# Altium schematic sheet 8_LEDS.SchDoc: SmartHalo V1.0 Rev1 - Leds
size B; Author: Sébastien Gélinas; Organization: CycleLabs Solutions Inc.; Address1: 5445 de Gaspé; Address2: Montréal, QC; Address3: Canada; Address4: H2T 3B2; Revision: 1; SheetNumber: 8; SheetTotal: 8
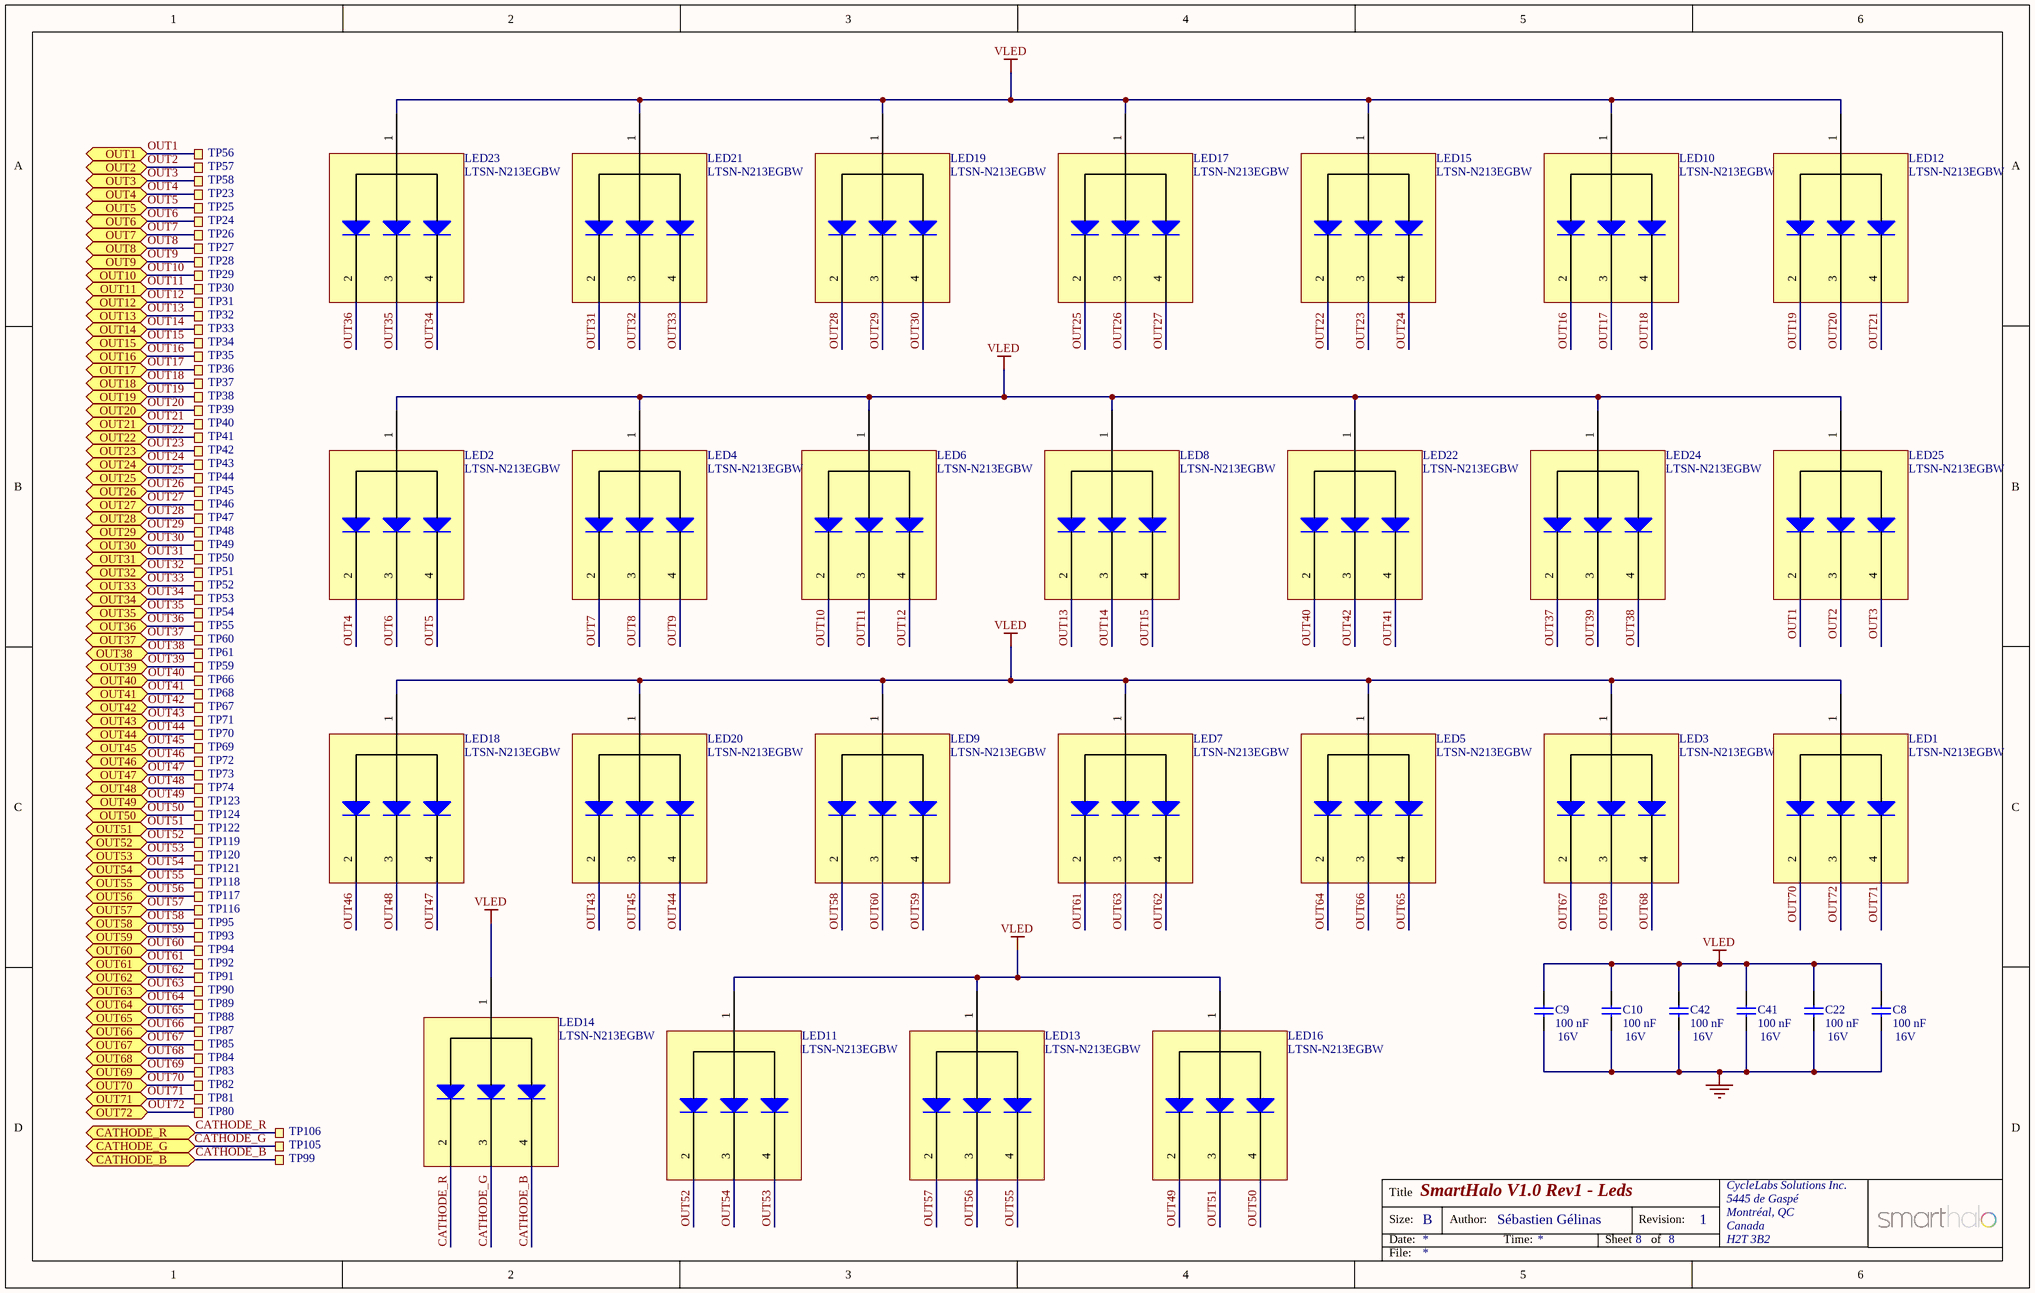
[diagram p0: 8_LEDS.SchDoc]

## Parts
C8  100 nF  Voltage Rating: 16V  [Varitron_CAP0402]
C9  100 nF  Voltage Rating: 16V  [Varitron_CAP0402]
C10  100 nF  Voltage Rating: 16V  [Varitron_CAP0402]
C22  100 nF  Voltage Rating: 16V  [Varitron_CAP0402]
C41  100 nF  Voltage Rating: 16V  [Varitron_CAP0402]
C42  100 nF  Voltage Rating: 16V  [Varitron_CAP0402]
LED1  LTSN-N213EGBW  [LTSN-N213EGBW]
LED2  LTSN-N213EGBW  [LTSN-N213EGBW]
LED3  LTSN-N213EGBW  [LTSN-N213EGBW]
LED4  LTSN-N213EGBW  [LTSN-N213EGBW]
LED5  LTSN-N213EGBW  [LTSN-N213EGBW]
LED6  LTSN-N213EGBW  [LTSN-N213EGBW]
LED7  LTSN-N213EGBW  [LTSN-N213EGBW]
LED8  LTSN-N213EGBW  [LTSN-N213EGBW]
LED9  LTSN-N213EGBW  [LTSN-N213EGBW]
LED10  LTSN-N213EGBW  [LTSN-N213EGBW]
LED11  LTSN-N213EGBW  [LTSN-N213EGBW]
LED12  LTSN-N213EGBW  [LTSN-N213EGBW]
LED13  LTSN-N213EGBW  [LTSN-N213EGBW]
LED14  LTSN-N213EGBW  [LTSN-N213EGBW]
LED15  LTSN-N213EGBW  [LTSN-N213EGBW]
LED16  LTSN-N213EGBW  [LTSN-N213EGBW]
LED17  LTSN-N213EGBW  [LTSN-N213EGBW]
LED18  LTSN-N213EGBW  [LTSN-N213EGBW]
LED19  LTSN-N213EGBW  [LTSN-N213EGBW]
LED20  LTSN-N213EGBW  [LTSN-N213EGBW]
LED21  LTSN-N213EGBW  [LTSN-N213EGBW]
LED22  LTSN-N213EGBW  [LTSN-N213EGBW]
LED23  LTSN-N213EGBW  [LTSN-N213EGBW]
LED24  LTSN-N213EGBW  [LTSN-N213EGBW]
LED25  LTSN-N213EGBW  [LTSN-N213EGBW]
TP23  TP23  [TESTPAD-TH-35mils]  (value not drawn)  (no BOM)
TP24  TP24  [TESTPAD-TH-35mils]  (value not drawn)  (no BOM)
TP25  TP25  [TESTPAD-TH-35mils]  (value not drawn)  (no BOM)
TP26  TP26  [TESTPAD-TH-35mils]  (value not drawn)  (no BOM)
TP27  TP27  [TESTPAD-TH-35mils]  (value not drawn)  (no BOM)
TP28  TP28  [TESTPAD-TH-35mils]  (value not drawn)  (no BOM)
TP29  TP29  [TESTPAD-TH-35mils]  (value not drawn)  (no BOM)
TP30  TP30  [TESTPAD-TH-35mils]  (value not drawn)  (no BOM)
TP31  TP31  [TESTPAD-TH-35mils]  (value not drawn)  (no BOM)
TP32  TP32  [TESTPAD-TH-35mils]  (value not drawn)  (no BOM)
TP33  TP33  [TESTPAD-TH-35mils]  (value not drawn)  (no BOM)
TP34  TP34  [TESTPAD-TH-35mils]  (value not drawn)  (no BOM)
TP35  TP35  [TESTPAD-TH-35mils]  (value not drawn)  (no BOM)
TP36  TP36  [TESTPAD-TH-35mils]  (value not drawn)  (no BOM)
TP37  TP37  [TESTPAD-TH-35mils]  (value not drawn)  (no BOM)
TP38  TP38  [TESTPAD-TH-35mils]  (value not drawn)  (no BOM)
TP39  TP39  [TESTPAD-TH-35mils]  (value not drawn)  (no BOM)
TP40  TP40  [TESTPAD-TH-35mils]  (value not drawn)  (no BOM)
TP41  TP41  [TESTPAD-TH-35mils]  (value not drawn)  (no BOM)
TP42  TP42  [TESTPAD-TH-35mils]  (value not drawn)  (no BOM)
TP43  TP43  [TESTPAD-TH-35mils]  (value not drawn)  (no BOM)
TP44  TP44  [TESTPAD-TH-35mils]  (value not drawn)  (no BOM)
TP45  TP45  [TESTPAD-TH-35mils]  (value not drawn)  (no BOM)
TP46  TP46  [TESTPAD-TH-35mils]  (value not drawn)  (no BOM)
TP47  TP47  [TESTPAD-TH-35mils]  (value not drawn)  (no BOM)
TP48  TP48  [TESTPAD-TH-35mils]  (value not drawn)  (no BOM)
TP49  TP49  [TESTPAD-TH-35mils]  (value not drawn)  (no BOM)
TP50  TP50  [TESTPAD-TH-35mils]  (value not drawn)  (no BOM)
TP51  TP51  [TESTPAD-TH-35mils]  (value not drawn)  (no BOM)
TP52  TP52  [TESTPAD-TH-35mils]  (value not drawn)  (no BOM)
TP53  TP53  [TESTPAD-TH-35mils]  (value not drawn)  (no BOM)
TP54  TP54  [TESTPAD-TH-35mils]  (value not drawn)  (no BOM)
TP55  TP55  [TESTPAD-TH-35mils]  (value not drawn)  (no BOM)
TP56  TP56  [TESTPAD-TH-35mils]  (value not drawn)  (no BOM)
TP57  TP57  [TESTPAD-TH-35mils]  (value not drawn)  (no BOM)
TP58  TP58  [TESTPAD-TH-35mils]  (value not drawn)  (no BOM)
TP59  TP59  [TESTPAD-TH-35mils]  (value not drawn)  (no BOM)
TP60  TP60  [TESTPAD-TH-35mils]  (value not drawn)  (no BOM)
TP61  TP61  [TESTPAD-TH-35mils]  (value not drawn)  (no BOM)
TP66  TP66  [TESTPAD-TH-35mils]  (value not drawn)  (no BOM)
TP67  TP67  [TESTPAD-TH-35mils]  (value not drawn)  (no BOM)
TP68  TP68  [TESTPAD-TH-35mils]  (value not drawn)  (no BOM)
TP69  TP69  [TESTPAD-TH-35mils]  (value not drawn)  (no BOM)
TP70  TP70  [TESTPAD-TH-35mils]  (value not drawn)  (no BOM)
TP71  TP71  [TESTPAD-TH-35mils]  (value not drawn)  (no BOM)
TP72  TP72  [TESTPAD-TH-35mils]  (value not drawn)  (no BOM)
TP73  TP73  [TESTPAD-TH-35mils]  (value not drawn)  (no BOM)
TP74  TP74  [TESTPAD-TH-35mils]  (value not drawn)  (no BOM)
TP80  TP80  [TESTPAD-TH-35mils]  (value not drawn)  (no BOM)
TP81  TP81  [TESTPAD-TH-35mils]  (value not drawn)  (no BOM)
TP82  TP82  [TESTPAD-TH-35mils]  (value not drawn)  (no BOM)
TP83  TP83  [TESTPAD-TH-35mils]  (value not drawn)  (no BOM)
TP84  TP84  [TESTPAD-TH-35mils]  (value not drawn)  (no BOM)
TP85  TP85  [TESTPAD-TH-35mils]  (value not drawn)  (no BOM)
TP87  TP87  [TESTPAD-TH-35mils]  (value not drawn)  (no BOM)
TP88  TP88  [TESTPAD-TH-35mils]  (value not drawn)  (no BOM)
TP89  TP89  [TESTPAD-TH-35mils]  (value not drawn)  (no BOM)
TP90  TP90  [TESTPAD-TH-35mils]  (value not drawn)  (no BOM)
TP91  TP91  [TESTPAD-TH-35mils]  (value not drawn)  (no BOM)
TP92  TP92  [TESTPAD-TH-35mils]  (value not drawn)  (no BOM)
TP93  TP93  [TESTPAD-TH-35mils]  (value not drawn)  (no BOM)
TP94  TP94  [TESTPAD-TH-35mils]  (value not drawn)  (no BOM)
TP95  TP95  [TESTPAD-TH-35mils]  (value not drawn)  (no BOM)
TP99  TP99  [TESTPAD-TH-35mils]  (value not drawn)  (no BOM)
TP105  TP105  [TESTPAD-TH-35mils]  (value not drawn)  (no BOM)
TP106  TP106  [TESTPAD-TH-35mils]  (value not drawn)  (no BOM)
TP116  TP116  [TESTPAD-TH-35mils]  (value not drawn)  (no BOM)
TP117  TP117  [TESTPAD-TH-35mils]  (value not drawn)  (no BOM)
TP118  TP118  [TESTPAD-TH-35mils]  (value not drawn)  (no BOM)
TP119  TP119  [TESTPAD-TH-35mils]  (value not drawn)  (no BOM)
TP120  TP120  [TESTPAD-TH-35mils]  (value not drawn)  (no BOM)
TP121  TP121  [TESTPAD-TH-35mils]  (value not drawn)  (no BOM)
TP122  TP122  [TESTPAD-TH-35mils]  (value not drawn)  (no BOM)
TP123  TP123  [TESTPAD-TH-35mils]  (value not drawn)  (no BOM)
TP124  TP124  [TESTPAD-TH-35mils]  (value not drawn)  (no BOM)

## Ports
CATHODE_B, CATHODE_G, CATHODE_R, OUT1, OUT2, OUT3, OUT4, OUT5, OUT6, OUT7, OUT8, OUT9, OUT10, OUT11, OUT12, OUT13, OUT14, OUT15, OUT16, OUT17, OUT18, OUT19, OUT20, OUT21, OUT22, OUT23, OUT24, OUT25, OUT26, OUT27, OUT28, OUT29, OUT30, OUT31, OUT32, OUT33, OUT34, OUT35, OUT36, OUT37, OUT38, OUT39, OUT40, OUT41, OUT42, OUT43, OUT44, OUT45, OUT46, OUT47, OUT48, OUT49, OUT50, OUT51, OUT52, OUT53, OUT54, OUT55, OUT56, OUT57, OUT58, OUT59, OUT60, OUT61, OUT62, OUT63, OUT64, OUT65, OUT66, OUT67, OUT68, OUT69, OUT70, OUT71, OUT72

## Nets
GND: C8.2 C9.2 C10.2 C22.2 C41.2 C42.2
VLED: C8.1 C9.1 C10.1 C22.1 C41.1 C42.1 LED1.1(Anode) LED2.1(Anode) LED3.1(Anode) LED4.1(Anode) LED5.1(Anode) LED6.1(Anode) LED7.1(Anode) LED8.1(Anode) LED9.1(Anode) LED10.1(Anode) LED11.1(Anode) LED12.1(Anode) LED13.1(Anode) LED14.1(Anode) LED15.1(Anode) LED16.1(Anode) LED17.1(Anode) LED18.1(Anode) LED19.1(Anode) LED20.1(Anode) LED21.1(Anode) LED22.1(Anode) LED23.1(Anode) LED24.1(Anode) LED25.1(Anode)
CATHODE_B: LED14.4(Cathode_Blue) TP99.1 ; port CATHODE_B
CATHODE_G: LED14.3(Cathode_Green)
CATHODE_G: TP105.1 ; port CATHODE_G  [a separate net that carries the same name]
CATHODE_R: LED14.2(Cathode_Red) TP106.1 ; port CATHODE_R
OUT1: LED25.2(Cathode_Red) TP56.1 ; port OUT1
OUT2: LED25.3(Cathode_Green) TP57.1 ; port OUT2
OUT3: LED25.4(Cathode_Blue) TP58.1 ; port OUT3
OUT4: LED2.2(Cathode_Red) TP23.1 ; port OUT4
OUT5: LED2.4(Cathode_Blue) TP25.1 ; port OUT5
OUT6: LED2.3(Cathode_Green) TP24.1 ; port OUT6
OUT7: LED4.2(Cathode_Red) TP26.1 ; port OUT7
OUT8: LED4.3(Cathode_Green) TP27.1 ; port OUT8
OUT9: LED4.4(Cathode_Blue) TP28.1 ; port OUT9
OUT10: LED6.2(Cathode_Red) TP29.1 ; port OUT10
OUT11: LED6.3(Cathode_Green) TP30.1 ; port OUT11
OUT12: LED6.4(Cathode_Blue) TP31.1 ; port OUT12
OUT13: LED8.2(Cathode_Red) TP32.1 ; port OUT13
OUT14: LED8.3(Cathode_Green) TP33.1 ; port OUT14
OUT15: LED8.4(Cathode_Blue) TP34.1 ; port OUT15
OUT16: LED10.2(Cathode_Red) TP35.1 ; port OUT16
OUT17: LED10.3(Cathode_Green) TP36.1 ; port OUT17
OUT18: LED10.4(Cathode_Blue) TP37.1 ; port OUT18
OUT19: LED12.2(Cathode_Red) TP38.1 ; port OUT19
OUT20: LED12.3(Cathode_Green) TP39.1 ; port OUT20
OUT21: LED12.4(Cathode_Blue) TP40.1 ; port OUT21
OUT22: LED15.2(Cathode_Red) TP41.1 ; port OUT22
OUT23: LED15.3(Cathode_Green) TP42.1 ; port OUT23
OUT24: LED15.4(Cathode_Blue) TP43.1 ; port OUT24
OUT25: LED17.2(Cathode_Red) TP44.1 ; port OUT25
OUT26: LED17.3(Cathode_Green) TP45.1 ; port OUT26
OUT27: LED17.4(Cathode_Blue) TP46.1 ; port OUT27
OUT28: LED19.2(Cathode_Red) TP47.1 ; port OUT28
OUT29: LED19.3(Cathode_Green) TP48.1 ; port OUT29
OUT30: LED19.4(Cathode_Blue) TP49.1 ; port OUT30
OUT31: LED21.2(Cathode_Red) TP50.1 ; port OUT31
OUT32: LED21.3(Cathode_Green) TP51.1 ; port OUT32
OUT33: LED21.4(Cathode_Blue) TP52.1 ; port OUT33
OUT34: LED23.4(Cathode_Blue) TP53.1 ; port OUT34
OUT35: LED23.3(Cathode_Green) TP54.1 ; port OUT35
OUT36: LED23.2(Cathode_Red) TP55.1 ; port OUT36
OUT37: LED24.2(Cathode_Red) TP60.1 ; port OUT37
OUT38: LED24.4(Cathode_Blue) TP61.1 ; port OUT38
OUT39: LED24.3(Cathode_Green) TP59.1 ; port OUT39
OUT40: LED22.2(Cathode_Red) TP66.1 ; port OUT40
OUT41: LED22.4(Cathode_Blue) TP68.1 ; port OUT41
OUT42: LED22.3(Cathode_Green) TP67.1 ; port OUT42
OUT43: LED20.2(Cathode_Red) TP71.1 ; port OUT43
OUT44: LED20.4(Cathode_Blue) TP70.1 ; port OUT44
OUT45: LED20.3(Cathode_Green) TP69.1 ; port OUT45
OUT46: LED18.2(Cathode_Red) TP72.1 ; port OUT46
OUT47: LED18.4(Cathode_Blue) TP73.1 ; port OUT47
OUT48: LED18.3(Cathode_Green) TP74.1 ; port OUT48
OUT49: LED16.2(Cathode_Red) TP123.1 ; port OUT49
OUT50: LED16.4(Cathode_Blue) TP124.1 ; port OUT50
OUT51: LED16.3(Cathode_Green) TP122.1 ; port OUT51
OUT52: LED11.2(Cathode_Red) TP119.1 ; port OUT52
OUT53: LED11.4(Cathode_Blue) TP120.1 ; port OUT53
OUT54: LED11.3(Cathode_Green) TP121.1 ; port OUT54
OUT55: LED13.4(Cathode_Blue) TP118.1 ; port OUT55
OUT56: LED13.3(Cathode_Green) TP117.1 ; port OUT56
OUT57: LED13.2(Cathode_Red) TP116.1 ; port OUT57
OUT58: LED9.2(Cathode_Red) TP95.1 ; port OUT58
OUT59: LED9.4(Cathode_Blue) TP93.1 ; port OUT59
OUT60: LED9.3(Cathode_Green) TP94.1 ; port OUT60
OUT61: LED7.2(Cathode_Red) TP92.1 ; port OUT61
OUT62: LED7.4(Cathode_Blue) TP91.1 ; port OUT62
OUT63: LED7.3(Cathode_Green) TP90.1 ; port OUT63
OUT64: LED5.2(Cathode_Red) TP89.1 ; port OUT64
OUT65: LED5.4(Cathode_Blue) TP88.1 ; port OUT65
OUT66: LED5.3(Cathode_Green) TP87.1 ; port OUT66
OUT67: LED3.2(Cathode_Red) TP85.1 ; port OUT67
OUT68: LED3.4(Cathode_Blue) TP84.1 ; port OUT68
OUT69: LED3.3(Cathode_Green) TP83.1 ; port OUT69
OUT70: LED1.2(Cathode_Red) TP82.1 ; port OUT70
OUT71: LED1.4(Cathode_Blue) TP81.1 ; port OUT71
OUT72: LED1.3(Cathode_Green) TP80.1 ; port OUT72

## Notes on the sheet
- Labels drawn without touching a wire or pin: CATHODE_G
- Title
- Size:
- Date:
- B
- Author:
- Time:
- Sheet
- Revision:
- of
- File:

## Library data of the parts
C8-C10 C22 C41 C42 = Varitron_CAP0402: 100 nF 16V X7R 10% 0402 (1005 Metric)  SMD; Manufacturer: Samsung; Manufacturer Part Number: CL05B104KO5NNNC; SmartHalo Part Number: 630003-01; Case-EIA: 0402; Case-Metric: 1005; Final: Y; Tolerance: 10%; Technology: SMT; Temperature Coefficient: X7R; Part Number: CL05B104KO5NNNC; Value: 100 nF; Supplier: Arrow Electronics; Footprint Name: 0402
LED1-LED25 = LTSN-N213EGBW: LED SMD LTSN-N213EGBW; Manufacturer: LiteOn; SmartHalo Part Number: 630029-01; Final: Y; Manufacturer Part Number: LTSN-N213EGBW; Part Number: LTSN-N213EGBW; Footprint Name: CUSTOM(4 pins); Supplier: Arrow Electronics
TP23-TP61 TP66-TP74 TP80-TP85 TP87-TP95 TP99 TP105 TP106 TP116-TP124 = TESTPAD_TH_35mils: Testpoint, through hole, 35 mils; Value: TP